# Altium schematic sheet main-board.SchDoc
size A3
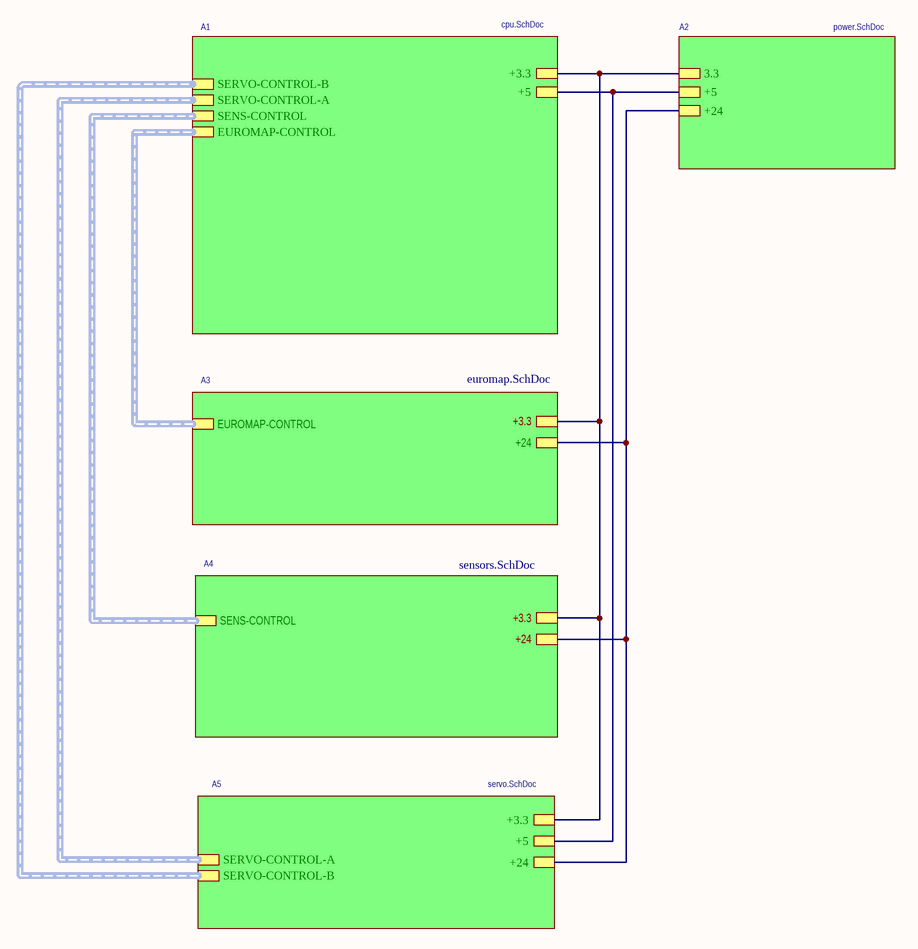
[diagram p0: main-board.SchDoc]

## Sub-sheets
A1 = cpu.SchDoc: +3.3, +5, SERVO-CONTROL-B (harness SERVO-CONTROL-B), SERVO-CONTROL-A (harness SERVO-CONTROL-A), SENS-CONTROL (harness SENS-CONTROL), EUROMAP-CONTROL (harness EUROMAP-CONTROL)
A2 = power.SchDoc: +5, +24, 3.3
A3 = euromap.SchDoc: +3.3, EUROMAP-CONTROL (harness EUROMAP-CONTROL), +24
A4 = sensors.SchDoc: SENS-CONTROL (harness SENS-CONTROL), +24, +3.3
A5 = servo.SchDoc: +5, +24, +3.3, SERVO-CONTROL-A (harness SERVO-CONTROL-A), SERVO-CONTROL-B (harness SERVO-CONTROL-B)

## Nets
(unnamed): sheet A1/+3.3, sheet A2/3.3, sheet A5/+3.3, sheet A4/+3.3, sheet A3/+3.3
(unnamed): sheet A1/+5, sheet A2/+5, sheet A5/+5
(unnamed): sheet A2/+24, sheet A5/+24, sheet A4/+24, sheet A3/+24

## Buses and harness runs
harness sheet A1/EUROMAP-CONTROL = sheet A3/EUROMAP-CONTROL
harness sheet A1/SENS-CONTROL = sheet A4/SENS-CONTROL
harness sheet A1/SERVO-CONTROL-A = sheet A5/SERVO-CONTROL-A
harness sheet A1/SERVO-CONTROL-B = sheet A5/SERVO-CONTROL-B